# EAGLE schematic Arduino_Shield (EAGLE 7.1.0)
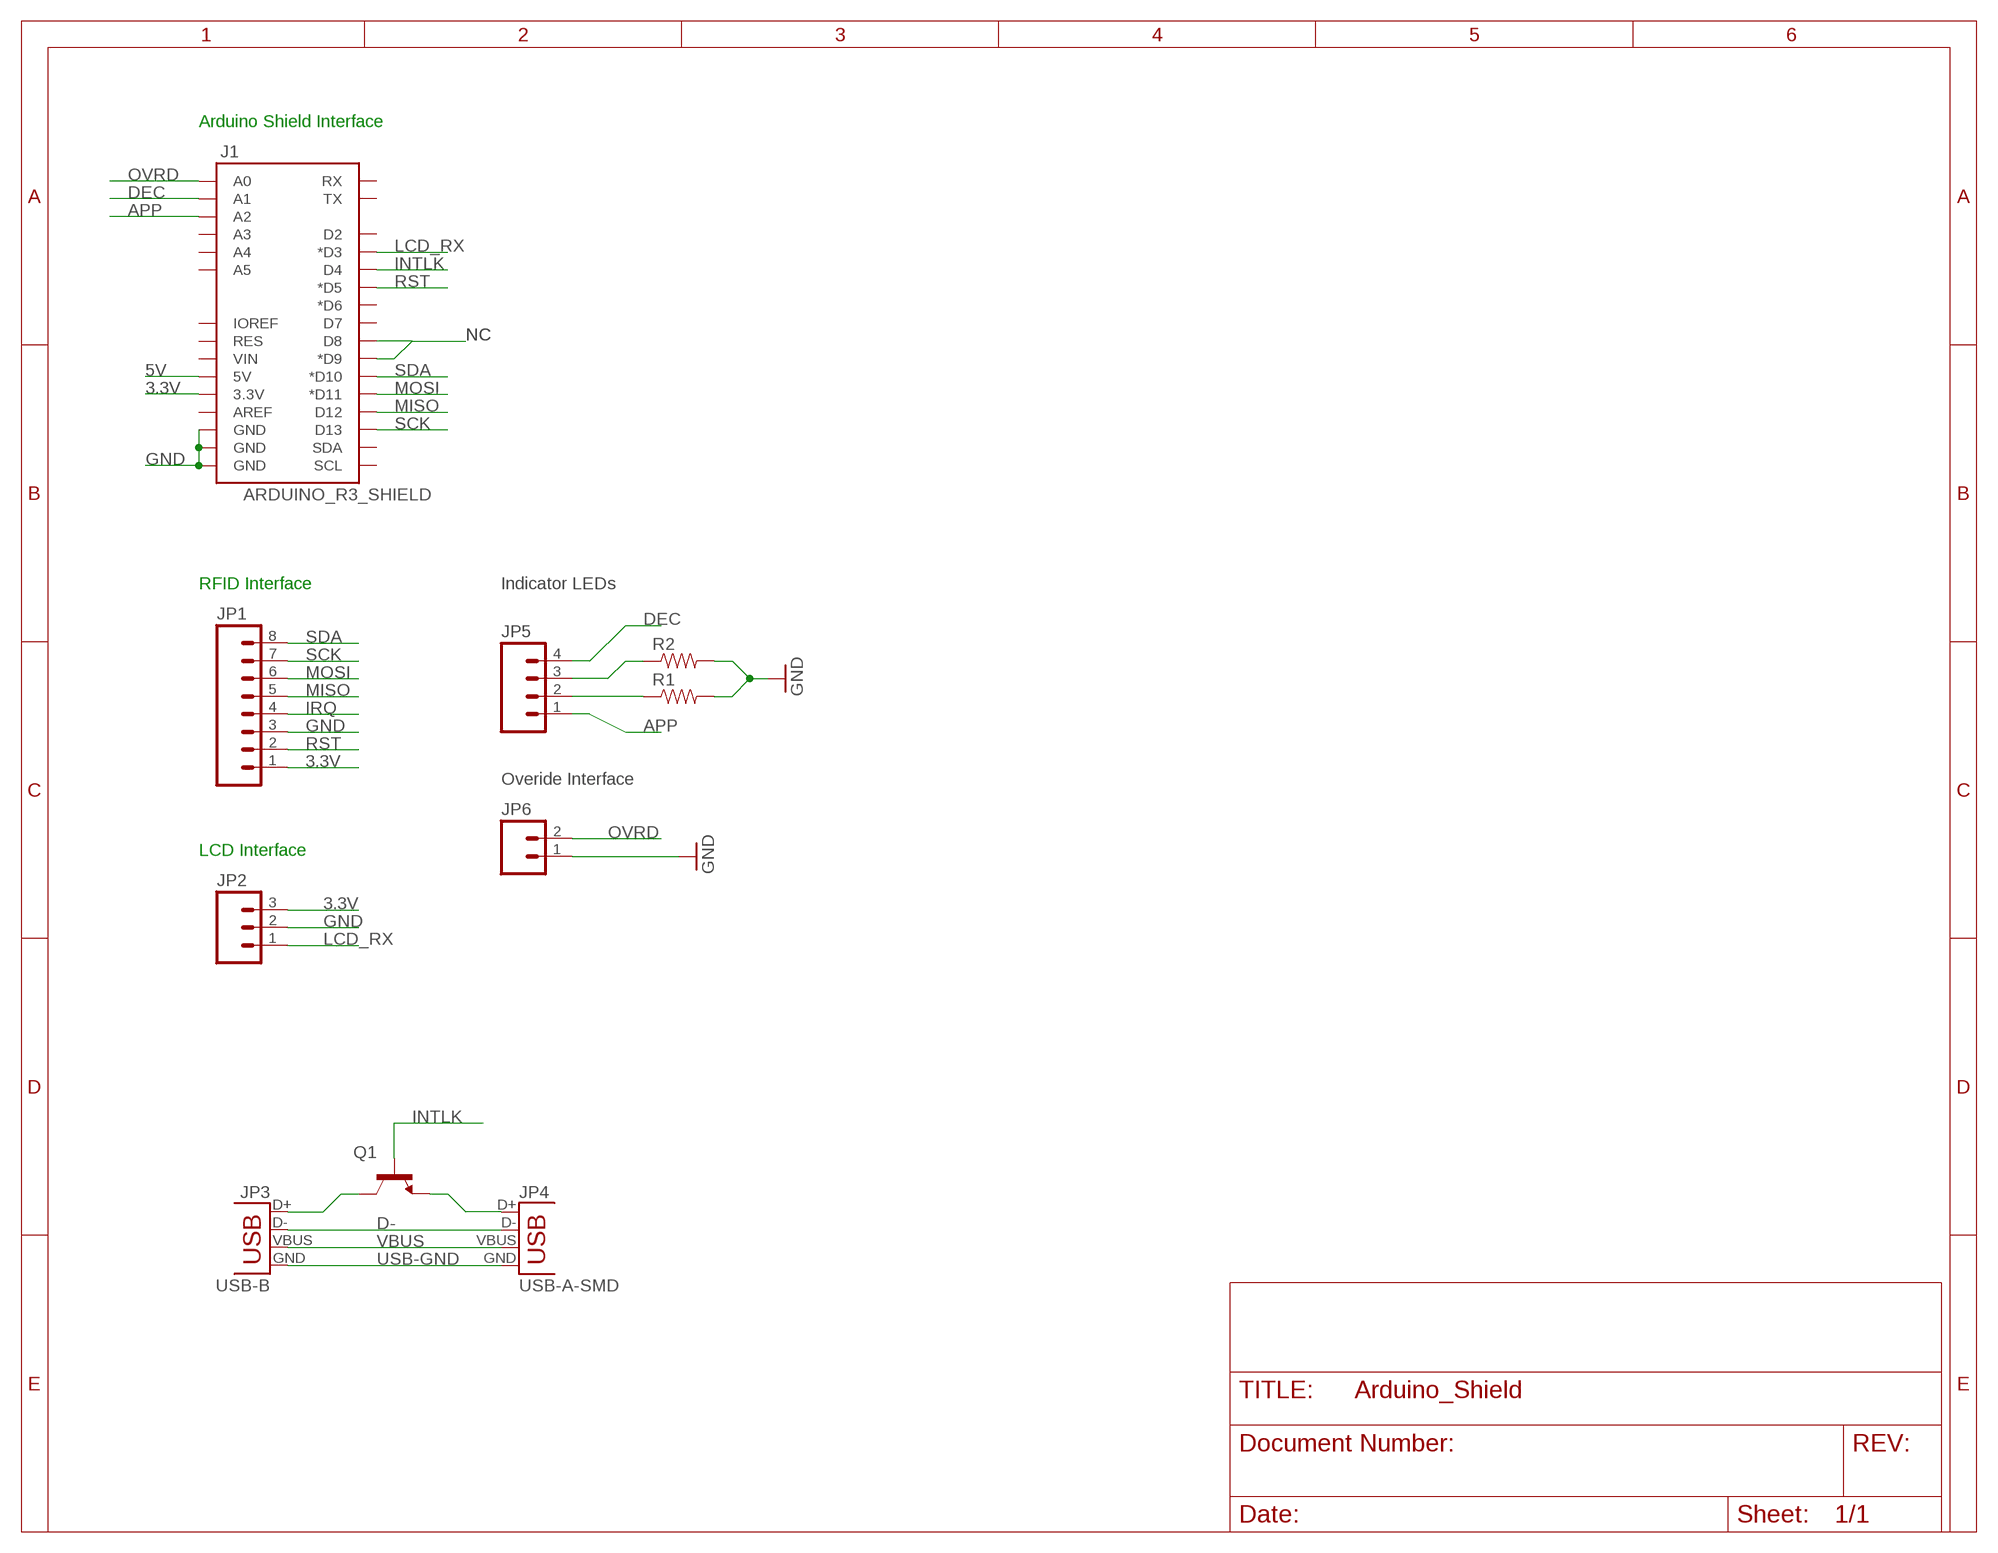
[diagram p0: schematic, sheet 1]

## Parts
J1  ARDUINO_R3_SHIELD  [UNO_R3_SHIELD]
JP1  M08LONGPADS  [1X08_LONGPADS]
JP2  M03LONGPADS  [1X03_LONGPADS]
JP3  USB-B  USBPTH  [USB-B-PTH]
JP4  USB-A-SMD  [USB-A-S-NOSILK-FEMALE]
JP5  M04LONGPADS  [1X04_LONGPADS]
JP6  M02LOCK_LONGPADS  [1X02_LOCK_LONGPADS]
Q1  TRANSISTOR_NPNBC547  [TO-92-AMMO]
R1  RESISTORPTH-1/4W  [AXIAL-0.4]
R2  RESISTORPTH-1/4W  [AXIAL-0.4]

## Nets
3.3V: J1.3.3V JP1.1 JP2.3
5V: J1.5V
APP: J1.A2 JP5.1
D-: JP3.D- JP4.D-
DEC: J1.A1 JP5.4
GND: J1.GND@0(GND) J1.GND@1(GND) J1.GND@2(GND) JP1.3 JP2.2 JP6.1 R1.P$2 R2.P$2
INTLK: J1.D4 Q1.2(B)
IRQ: JP1.4
LCD_RX: J1.D3(*D3) JP2.1
MISO: J1.D12 JP1.5
MOSI: J1.D11(*D11) JP1.6
N$1: J1.D8 J1.D9(*D9)
N$4: JP3.D+ Q1.1(C)
N$5: JP4.D+ Q1.3(E)
N$6: JP5.2 R1.P$1
N$7: JP5.3 R2.P$1
OVRD: J1.A0 JP6.2
RST: J1.D5(*D5) JP1.2
SCK: J1.D13 JP1.7
SDA: J1.D10(*D10) JP1.8
USB-GND: JP3.GND JP4.GND
VBUS: JP3.VBUS JP4.VBUS
Unconnected: J1.A3 J1.A4 J1.A5 J1.AREF J1.D2 J1.D6(*D6) J1.D7 J1.IOREF J1.RES J1.RX J1.SCL J1.SDA J1.TX J1.VIN

## Notes on the sheet
- Arduino Shield Interface
- NC | NC
- RFID Interface | Indicator LEDs
- Overide Interface
- LCD Interface

## Library data of the parts
J1 = SparkFun-Boards:ARDUINO_R3_SHIELD: Shield form compatible with the Arduino Uno R3.
JP1 = SparkFun-Connectors:M08: Header 8 Standard 8-pin 0.1" header. Use with straight break away headers (SKU : PRT-00116), right angle break away headers (PRT-00553), swiss pins (PRT-00743), machine pins (PRT-00117), and female headers (PRT-00115).
JP2 = SparkFun-Connectors:M03: Header 3 Standard 3-pin 0.1" header. Use with straight break away headers (SKU : PRT-00116), right angle break away headers (PRT-00553), swiss pins (PRT-00743), machine pins (PRT-00117), and female headers (PRT-00115). Molex polarized connector foot print use with SKU : PRT-08232 with associated crimp pins and housings.
JP3 = SparkFun-Connectors:USB: USB Connectors USB-B-PTH is fully proven SKU : PRT-00139/CONN-08278 USB-miniB is fully proven SKU : PRT-00587 USB-A-PCB is untested. USB-A-H is throughly reviewed, but untested. Spark Fun Electronics SKU : PRT-00437 USB-B-SMT is throughly reviewed, but untested. Needs silkscreen touching up. USB-A-S has not been used/tested USB-MB-H has not been used/tested USB-MICROB has been used. CONN-09505; PROD_ID: CONN-08278
JP4 = SparkFun-Connectors:USB: USB Connectors USB-B-PTH is fully proven SKU : PRT-00139/CONN-08278 USB-miniB is fully proven SKU : PRT-00587 USB-A-PCB is untested. USB-A-H is throughly reviewed, but untested. Spark Fun Electronics SKU : PRT-00437 USB-B-SMT is throughly reviewed, but untested. Needs silkscreen touching up. USB-A-S has not been used/tested USB-MB-H has not been used/tested USB-MICROB has been used. CONN-09505; PROD_ID: CONN-09520
JP5 = SparkFun-Connectors:M04: Header 4 Standard 4-pin 0.1" header. Use with straight break away headers (SKU : PRT-00116), right angle break away headers (PRT-00553), swiss pins (PRT-00743), machine pins (PRT-00117), and female headers (PRT-00115). Molex polarized connector foot print use with SKU : PRT-08231 with associated crimp pins and housings. 1MM SMD Version SKU: PRT-10208
JP6 = SparkFun-Connectors:M02: Standard 2-pin 0.1" header. Use with - straight break away headers ( PRT-00116) - right angle break away headers (PRT-00553) - swiss pins (PRT-00743) - machine pins (PRT-00117) - female headers (PRT-00115) Molex polarized connector foot print use with: PRT-08233 with associated crimp pins and housings. 2.54_SCREWTERM for use with PRT-10571. 3.5mm Screw Terminal footprints for PRT-08084 5mm Screw Terminal footprints for use with PRT-08432
Q1 = SparkFun-DiscreteSemi:TRANSISTOR_NPN: Generic NPN BJT MMBT2222A - TRANS-08049 (SOT-23, 1A 40V) MPSA42 - TRANS-09116 (SOT-23, 500mA 300V) MMBT5088LT1G - TRANS-11160 (SOT-23, 50 mA 30V) BC547 - COM-08928 <http://www.sparkfun.com/products/8928> (TO-92 45V 100mA) (1.Collector 2.Base 3.Emitter) 2N3904 - COM-00521 <http://www.sparkfun.com/products/521> (TO-92 40V 200mA) (1.Emitter 2.Base 3.Collector) P2N2222A - COM-12852 <http://www.sparkfun.com/products/12852> (TO-92 40V 600mA) (1.Collector 2.Base 3.Emitter)
R1 R2 = SparkFun-Resistors:RESISTOR: Resistor Basic schematic elements and footprints for 0603, 1206, and PTH resistors.